# Altium project RPi-rev.1.PrjPcb
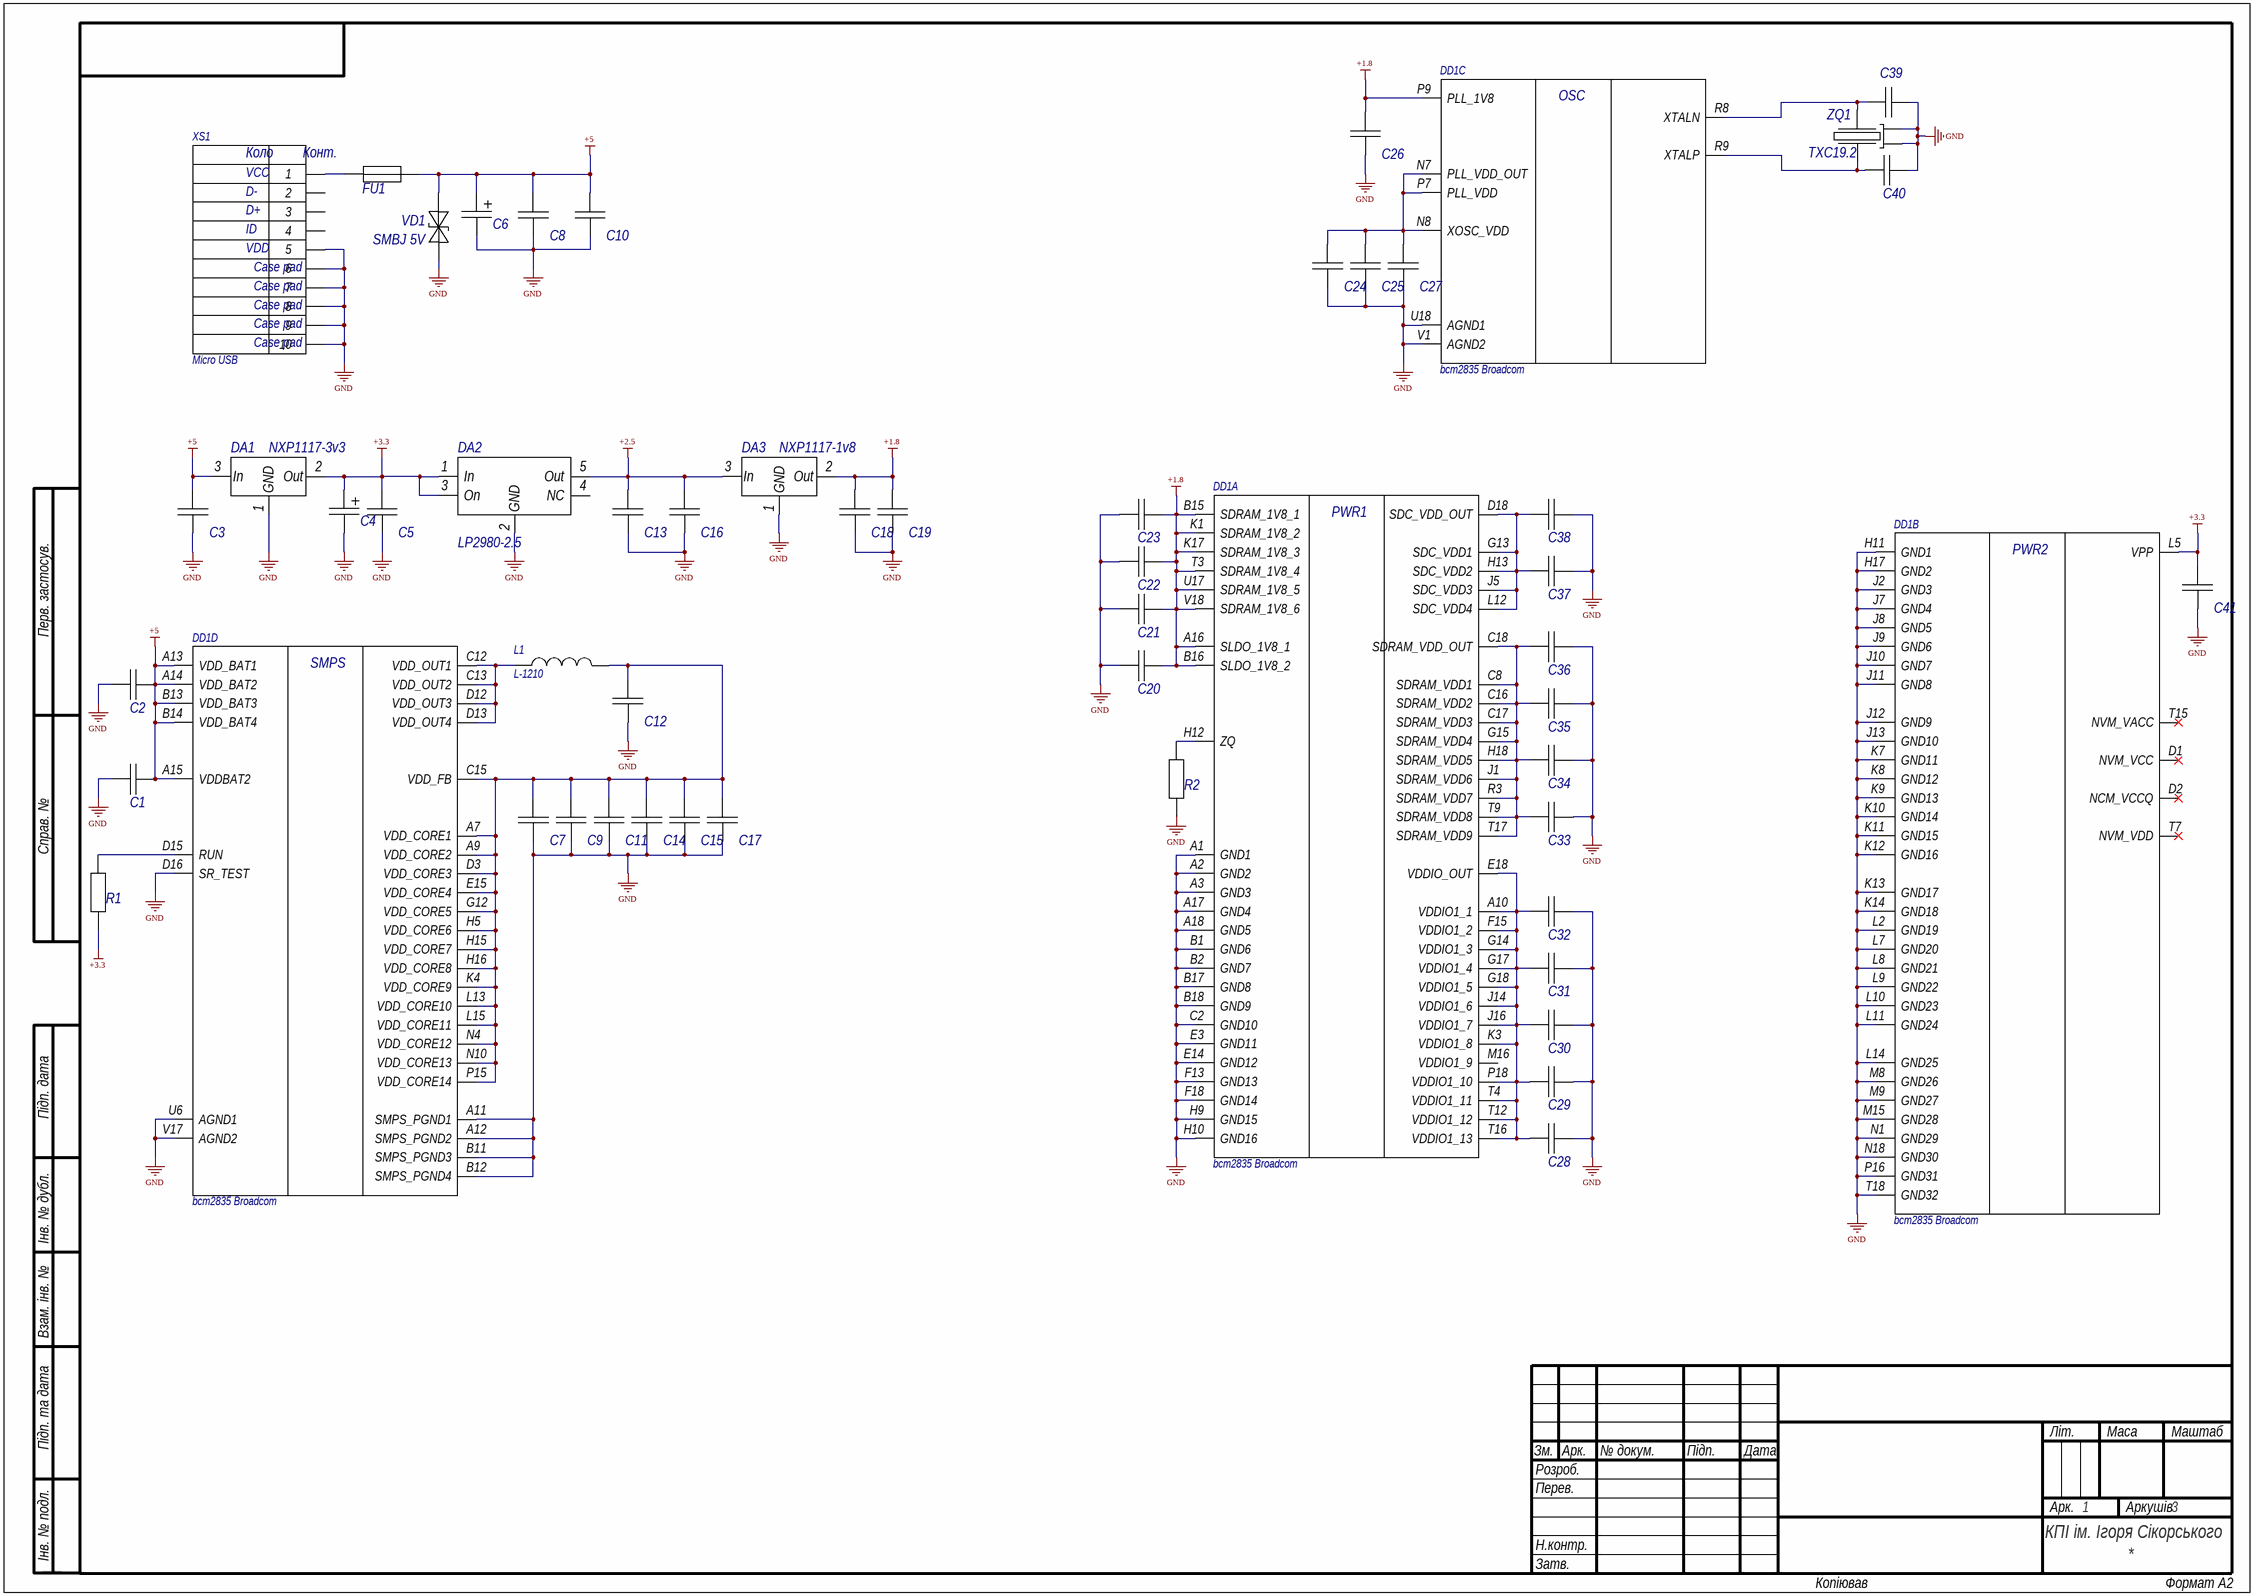
[diagram p0: Power.SchDoc]
3 sheets, 117 parts. Net scope: flat (ports and power ports of the same name join across sheets).
Board file: RPi.PcbDoc
Sheets:
  Power.SchDoc
  HDMI.SchDoc
  LAN.SchDoc

## Sheet Power.SchDoc
size 594 x 420 mm; SheetNumber: 1; SheetTotal: 3

### Parts
C1  C-0603 * * * * *  [С-0603]  (value not drawn)
C2  C-0603 * * * * *  [С-0603]  (value not drawn)
C3  C-0805 * * * * *  [C-0805-KEM]  (value not drawn)
C4  C * * * * *  [PCAP_SVP_C6_PAN]  (value not drawn)
C5  C-0805 * * * * *  [C-0805-KEM]  (value not drawn)
C6  C * * * * *  [PCAP_SVP_C6_PAN]  (value not drawn)
C7  C-0603 * * * * *  [С-0603]  (value not drawn)
C8  C-1206 * * * * *  [C-1206]  (value not drawn)
C9  C-0603 * * * * *  [С-0603]  (value not drawn)
C10  C-0805 * * * * *  [C-0805-KEM]  (value not drawn)
C11  C-0603 * * * * *  [С-0603]  (value not drawn)
C12  C-1206 * * * * *  [C-1206]  (value not drawn)
C13  C-1206 * * * * *  [C-1206]  (value not drawn)
C14  C-0603 * * * * *  [С-0603]  (value not drawn)
C15  C-0603 * * * * *  [С-0603]  (value not drawn)
C16  C-0805 * * * * *  [C-0805-KEM]  (value not drawn)
C17  C-0603 * * * * *  [С-0603]  (value not drawn)
C18  C-0805 * * * * *  [C-0805-KEM]  (value not drawn)
C19  C-0603 * * * * *  [С-0603]  (value not drawn)
C20  C-0603 * * * * *  [С-0603]  (value not drawn)
C21  C-0603 * * * * *  [С-0603]  (value not drawn)
C22  C-0603 * * * * *  [С-0603]  (value not drawn)
C23  C-0603 * * * * *  [С-0603]  (value not drawn)
C24  C-0603 * * * * *  [С-0603]  (value not drawn)
C25  C-0603 * * * * *  [С-0603]  (value not drawn)
C26  C-0603 * * * * *  [С-0603]  (value not drawn)
C27  C-0603 * * * * *  [С-0603]  (value not drawn)
C28  C-0603 * * * * *  [С-0603]  (value not drawn)
C29  C-0603 * * * * *  [С-0603]  (value not drawn)
C30  C-0603 * * * * *  [С-0603]  (value not drawn)
C31  C-0603 * * * * *  [С-0603]  (value not drawn)
C32  C-0603 * * * * *  [С-0603]  (value not drawn)
C33  C-0603 * * * * *  [С-0603]  (value not drawn)
C34  C-0603 * * * * *  [С-0603]  (value not drawn)
C35  C-0603 * * * * *  [С-0603]  (value not drawn)
C36  C-0603 * * * * *  [С-0603]  (value not drawn)
C37  C-0603 * * * * *  [С-0603]  (value not drawn)
C38  C-0603 * * * * *  [С-0603]  (value not drawn)
C39  C-0402 * * * * *  [C-0402]  (value not drawn)
C40  C-0402 * * * * *  [C-0402]  (value not drawn)
C41  C-0603 * * * * *  [С-0603]  (value not drawn)
DA1  NXP1117-3v3  [D2PAK3_ONS]
DA2  LP2980-2.5  [MF05A_TEX-L]
DA3  NXP1117-1v8  [D2PAK3_ONS]
DD1  bcm2835 Broadcom  [BGA81C65P18X18_1200X1200]  (parts A,B,C,D of 16)
FU1  F-1206 * * * *  [FUSE_1206]  (value not drawn)
L1  L-1210  [IND_NC_SUM]
R1  R-0603 * * * *  [R-0603]  (value not drawn)
R2  R-0603 * * * *  [R-0603]  (value not drawn)
VD1  SMBJ 5V *  [SMB_STM]  (value not drawn)
XS1  Micro USB  [micro-usb]
ZQ1  TXC19.2 *  [CRYSTAL_TXC_7B]  (value not drawn)

### Nets
+1.8: C18.2 C19.2 C20.2 C21.2 C22.2 C23.2 C26.2 DA3.2(Out) DD1.A16(SLDO_1V8_1) DD1.B15(SDRAM_1V8_1) DD1.B16(SLDO_1V8_2) DD1.K1(SDRAM_1V8_2) DD1.K17(SDRAM_1V8_3) DD1.P9(PLL_1V8) DD1.T3(SDRAM_1V8_4) DD1.U17(SDRAM_1V8_5) DD1.V18(SDRAM_1V8_6)
+2.5: C13.2 C16.2 DA2.5(Out) DA3.3(In)
+3.3: C4.1 C5.2 C41.2 DA1.2(Out) DA2.1(In) DA2.3(On) DD1.L5(VPP) R1.2
+5: C1.1 C2.1 C3.2 C6.1 C8.2 C10.2 DA1.3(In) DD1.A13(VDD_BAT1) DD1.A14(VDD_BAT2) DD1.A15(VDDBAT2) DD1.B13(VDD_BAT3) DD1.B14(VDD_BAT4) FU1.2 VD1.2
GND: C1.2 C2.2 C3.1 C4.2 C5.1 C6.2 C7.1 C8.1 C9.1 C10.1 C11.1 C12.1 C13.1 C14.1 C15.1 C16.1 C17.1 C18.1 C19.1 C20.1 C21.1 C22.1 C23.1 C24.1 C25.1 C26.1 C27.1 C28.1 C29.1 C30.1 C31.1 C32.1 C33.1 C34.1 C35.1 C36.1 C37.1 C38.1 C39.2 C40.2 C41.1 DA1.1(GND) DA2.2(GND) DA3.1(GND) DD1.A1(GND1) DD1.A2(GND2) DD1.A3(GND3) DD1.A11(SMPS_PGND1) DD1.A12(SMPS_PGND2) DD1.A17(GND4) DD1.A18(GND5) DD1.B1(GND6) DD1.B2(GND7) DD1.B11(SMPS_PGND3) DD1.B12(SMPS_PGND4) DD1.B17(GND8) DD1.B18(GND9) DD1.C2(GND10) DD1.D16(SR_TEST) DD1.E3(GND11) DD1.E14(GND12) DD1.F13(GND13) DD1.F18(GND14) DD1.H9(GND15) DD1.H10(GND16) DD1.H11(GND1) DD1.H17(GND2) DD1.J2(GND3) DD1.J7(GND4) DD1.J8(GND5) DD1.J9(GND6) DD1.J10(GND7) DD1.J11(GND8) DD1.J12(GND9) DD1.J13(GND10) DD1.K7(GND11) DD1.K8(GND12) DD1.K9(GND13) DD1.K10(GND14) DD1.K11(GND15) DD1.K12(GND16) DD1.K13(GND17) DD1.K14(GND18) DD1.L2(GND19) DD1.L7(GND20) DD1.L8(GND21) DD1.L9(GND22) DD1.L10(GND23) DD1.L11(GND24) DD1.L14(GND25) DD1.M8(GND26) DD1.M9(GND27) DD1.M15(GND28) DD1.N1(GND29) DD1.N18(GND30) DD1.P16(GND31) DD1.T18(GND32) DD1.U6(AGND1) DD1.U18(AGND1) DD1.V1(AGND2) DD1.V17(AGND2) R2.1 VD1.1 XS1.5 XS1.6 XS1.7 XS1.8 XS1.9 XS1.10 ZQ1.2 ZQ1.4
NetC7_2: C7.2 C9.2 C11.2 C12.2 C14.2 C15.2 C17.2 DD1.A7(VDD_CORE1) DD1.A9(VDD_CORE2) DD1.C15(VDD_FB) DD1.D3(VDD_CORE3) DD1.E15(VDD_CORE4) DD1.G12(VDD_CORE5) DD1.H5(VDD_CORE6) DD1.H15(VDD_CORE7) DD1.H16(VDD_CORE8) DD1.K4(VDD_CORE9) DD1.L13(VDD_CORE10) DD1.L15(VDD_CORE11) DD1.N4(VDD_CORE12) DD1.N10(VDD_CORE13) DD1.P15(VDD_CORE14) L1.2
NetC24_2: C24.2 C25.2 C27.2 DD1.N7(PLL_VDD_OUT) DD1.N8(XOSC_VDD) DD1.P7(PLL_VDD)
NetC28_2: C28.2 C29.2 C30.2 C31.2 C32.2 DD1.A10(VDDIO1_1) DD1.E18(VDDIO_OUT) DD1.F15(VDDIO1_2) DD1.G14(VDDIO1_3) DD1.G17(VDDIO1_4) DD1.G18(VDDIO1_5) DD1.J14(VDDIO1_6) DD1.J16(VDDIO1_7) DD1.K3(VDDIO1_8) DD1.P18(VDDIO1_10) DD1.T4(VDDIO1_11) DD1.T12(VDDIO1_12) DD1.T16(VDDIO1_13)
NetC33_2: C33.2 C34.2 C35.2 C36.2 DD1.G15(SDRAM_VDD4) DD1.H18(SDRAM_VDD5) DD1.J1(SDRAM_VDD6) DD1.R3(SDRAM_VDD7) DD1.T9(SDRAM_VDD8) DD1.T17(SDRAM_VDD9) DD1.С8(SDRAM_VDD1) DD1.С16(SDRAM_VDD2) DD1.С17(SDRAM_VDD3) DD1.С18(SDRAM_VDD_OUT)
NetC37_2: C37.2 C38.2 DD1.D18(SDC_VDD_OUT) DD1.G13(SDC_VDD1) DD1.H13(SDC_VDD2) DD1.J5(SDC_VDD3) DD1.L12(SDC_VDD4)
NetC39_1: C39.1 DD1.R8(XTALN) ZQ1.3
NetC40_1: C40.1 DD1.R9(XTALP) ZQ1.1
NetDD1_C12: DD1.C12(VDD_OUT1) DD1.C13(VDD_OUT2) DD1.D12(VDD_OUT3) DD1.D13(VDD_OUT4) L1.1
NetDD1_D15: DD1.D15(RUN) R1.1
NetDD1_H12: DD1.H12(ZQ) R2.2
NetFU1_1: FU1.1 XS1.1

Not connected (* = marked no-connect by the designer): DA2 4(NC); DD1 D1(NVM_VCC)* D2(NCM_VCCQ)* M16(VDDIO1_9) T7(NVM_VDD)* T15(NVM_VACC)*; XS1 2 3 4

### Notes on the sheet
- Перв. застосув.
- Справ. №
- Підп. дата
- Інв. № дубл.
- Взам. інв. №
- Підп. та дата
- Зм.
- Розроб.
- Арк.
- № докум.
- Підп.
- Дата
- Літ.
- Маса
- Маштаб
- Перев.
- Аркушів
- Інв. № подл.
- Н.контр.
- Затв.
- КПІ ім. Ігоря Сікорського
- ALTIUM GOSTBOM2.0 KEV
- Копіював
- Формат А2
- (in symbol bcm2835, part A) PWR1
- (in symbol bcm2835, part B) PWR2
- (in symbol bcm2835, part C) OSC
- (in symbol bcm2835, part D) SMPS
- (in symbol Micro-USB) Коло; Конт.; VCC; D-; D+; ID; VDD; Case pad

### Library data of the parts
C1 C2 C7 C9 C11 C14 C15 C17 C19-C38 C41 = С-0603: Generic; Manufacturer: *; Tolerance: *; Package: C-0603; Temp_Coef: *; Voltage: *; Value: *
C3 C5 C10 C16 C18 = С-0805: Generic; Manufacturer: *; Tolerance: *; Package: C-0805; Temp_Coef: *; Voltage: *; Value: *
C4 C6 = С: Generic electrolite SMT capacitor; Manufacturer: *; Tolerance: *; Package: C; Temp_Coef: *; Voltage: *; Value: *
C8 C12 C13 = С-1206: Generic; Manufacturer: *; Tolerance: *; Package: C-1206; Temp_Coef: *; Voltage: *; Value: *
C39 C40 = С-0402: Generic; Manufacturer: *; Tolerance: *; Package: C-0402; Temp_Coef: *; Voltage: *; Value: *
DA1 = NXP1117-3v3: LDO aat output 3.3V
DA2 = LP2980-2.5: LDO at output 2.5V
DA3 = NXP1117-1v8: LDO aat output 1.8V
DD1 = bcm2835: BCM2835 ARM-based processor; Manufacturer: Broadcom; Name: bcm2835
FU1 = F-1206: Generic Fuse 1206; Manufacturer: *; Tolerance: *; Package: F-1206; Power: *; Value: *
L1 = L-1210: Inductor; Name: L-1210
R1 R2 = R-0603: Generic; Manufacturer: *; Tolerance: *; Package: R-0603; Power: *; Value: *
VD1 = SMBJ 5V: TVS 5V Diode; Manufacturer: *; Name: SMBJ 5V
XS1 = Micro-USB: Micro-USB connector for SMT mounting; Name: kls1-tf
ZQ1 = TXC19.2: TXC19.2 crystal 19.2 MHz; Manufacturer: *; Value: *; Name: TXC19.2

## Sheet HDMI.SchDoc
size 593 x 419 mm; SheetNumber: 2; SheetTotal: 3
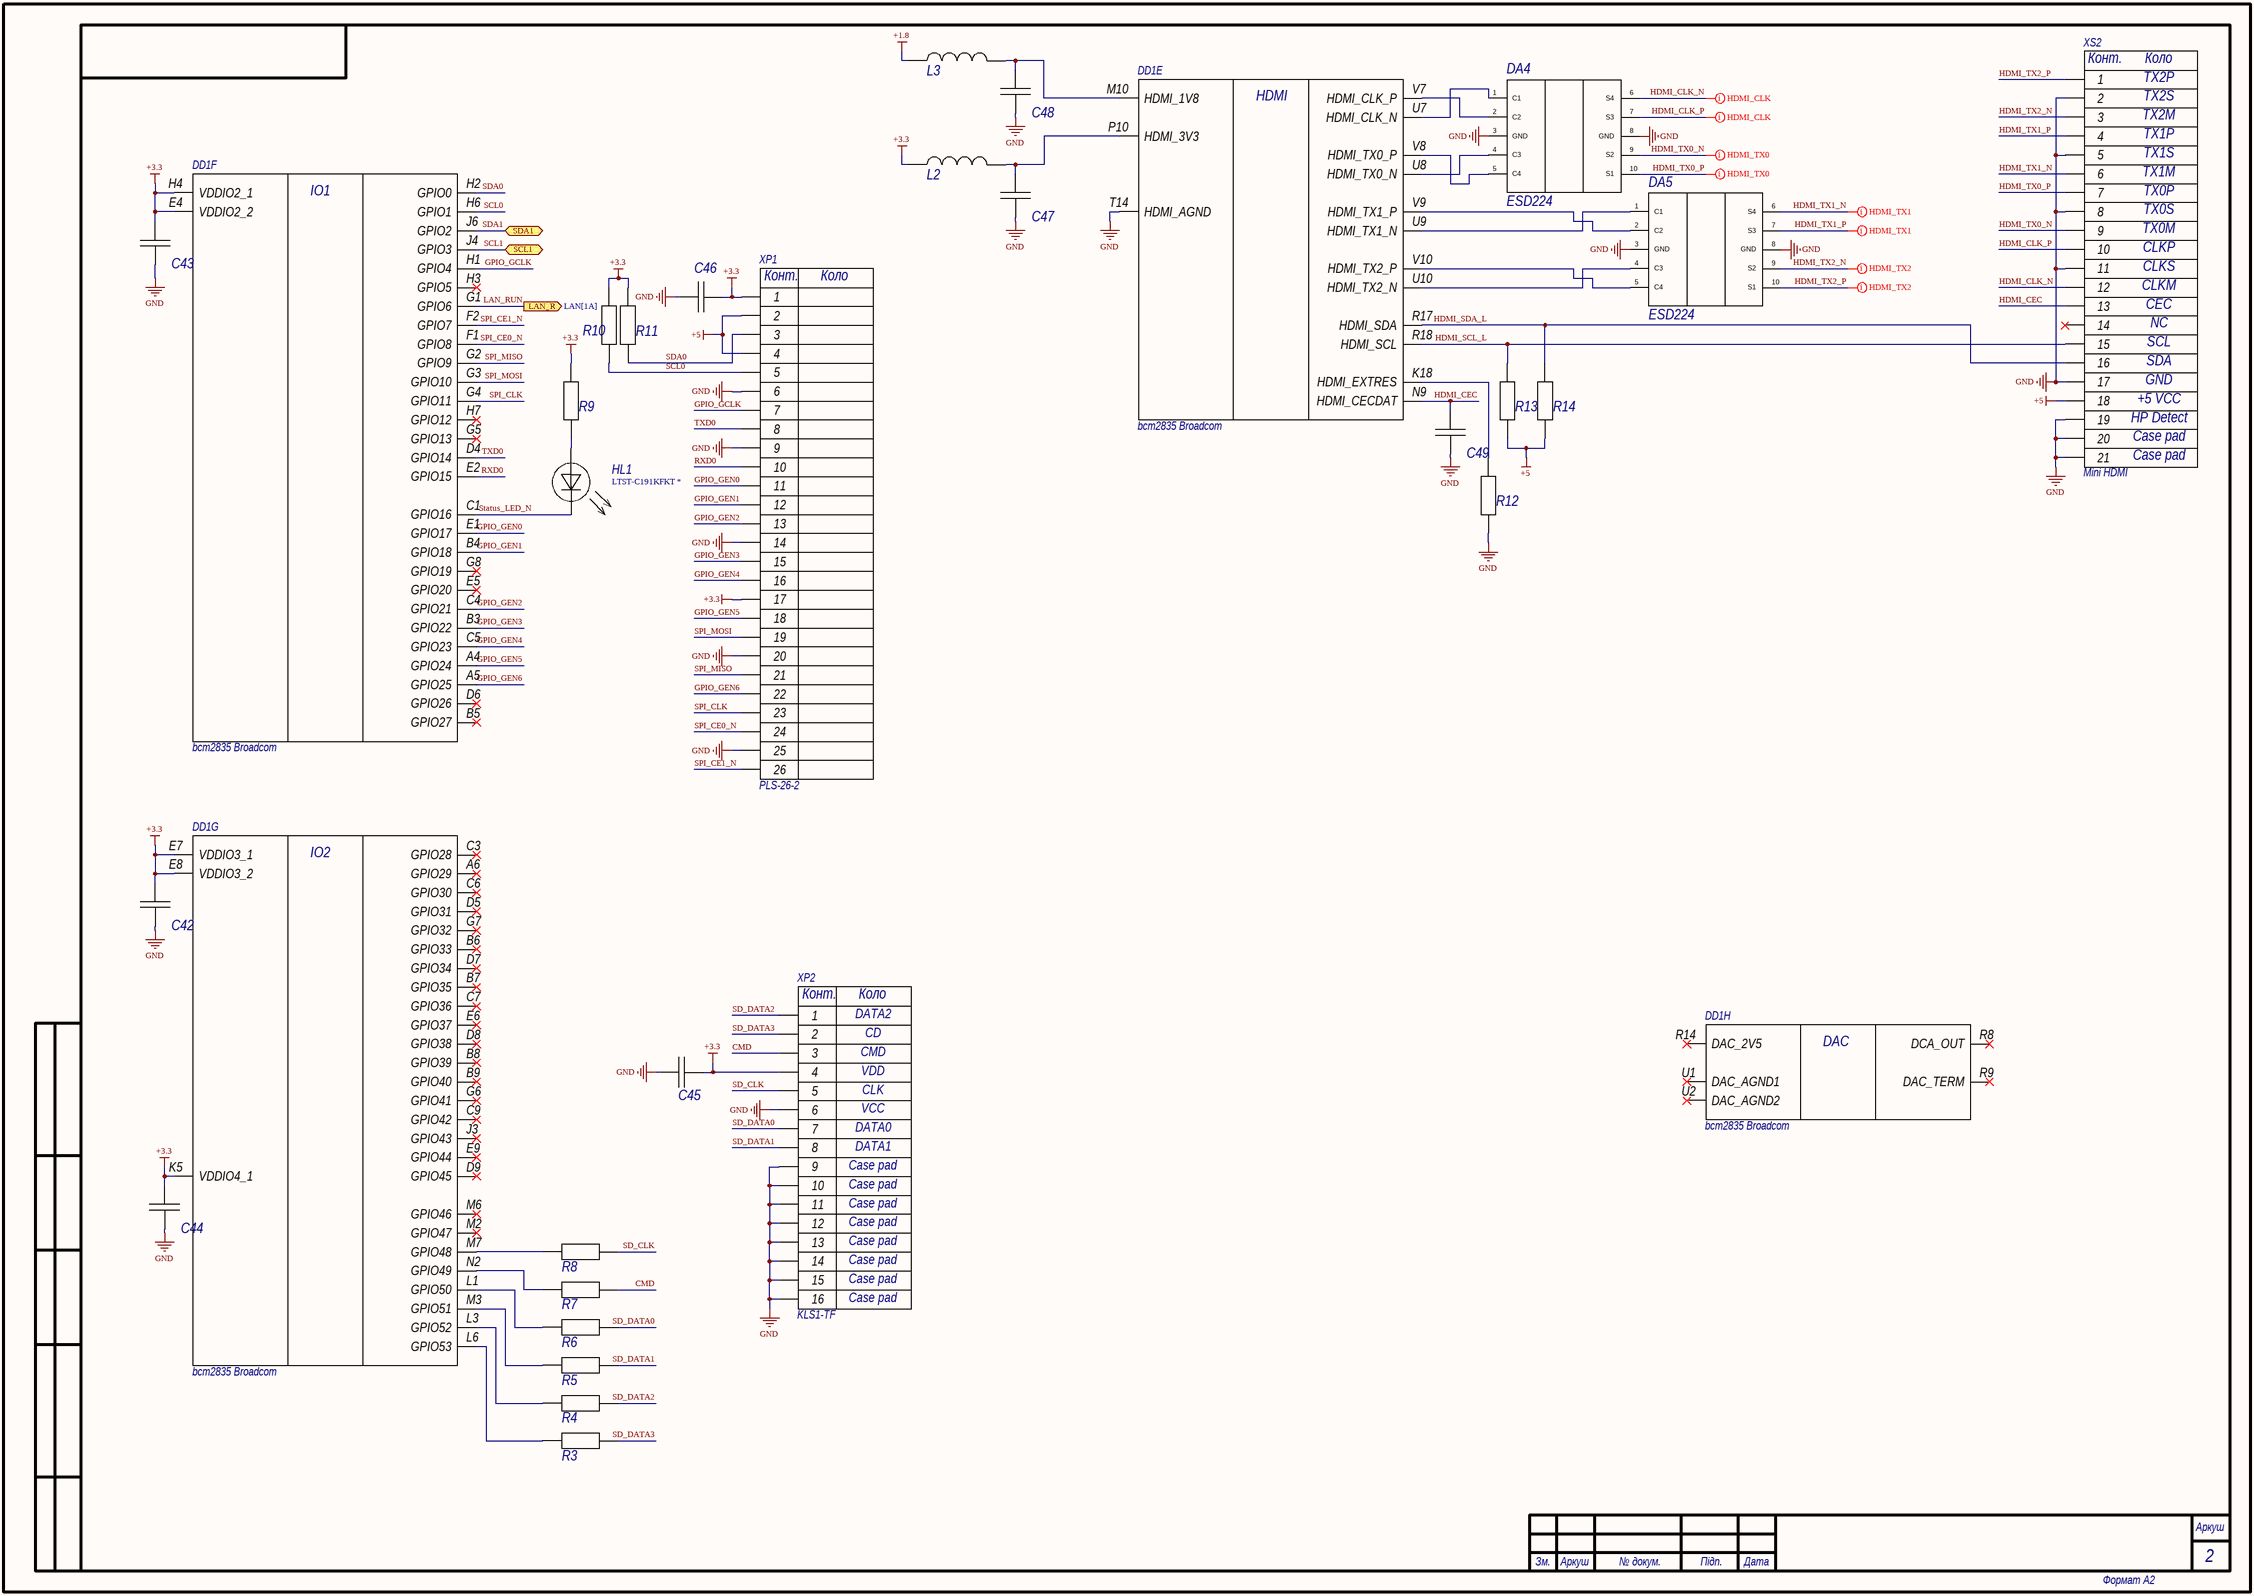
[diagram p1: HDMI.SchDoc]

### Parts
C42  C-0603 * * * * *  [С-0603]  (value not drawn)
C43  C-0603 * * * * *  [С-0603]  (value not drawn)
C44  C-0603 * * * * *  [С-0603]  (value not drawn)
C45  C-0603 * * * * *  [С-0603]  (value not drawn)
C46  C-0603 * * * * *  [С-0603]  (value not drawn)
C47  C-0805 * * * * *  [C-0805-KEM]  (value not drawn)
C48  C-0805 * * * * *  [C-0805-KEM]  (value not drawn)
C49  C-0402 * * * * *  [C-0402]  (value not drawn)
DA4  ESD224 *  [DQA0010A]  (value not drawn)
DA5  ESD224 *  [DQA0010A]  (value not drawn)
DD1  bcm2835 Broadcom  [BGA81C65P18X18_1200X1200]  (parts E,F,G,H of 16)
HL1  LTST-C191KFKT *  [LED_DIALIGHT_598_DIA]
L2  R-0402 * * * *  [FB-0805]  (value not drawn)
L3  R-0402 * * * *  [FB-0805]  (value not drawn)
R3  R-0603 * * * *  [R-0603]  (value not drawn)
R4  R-0603 * * * *  [R-0603]  (value not drawn)
R5  R-0603 * * * *  [R-0603]  (value not drawn)
R6  R-0603 * * * *  [R-0603]  (value not drawn)
R7  R-0603 * * * *  [R-0603]  (value not drawn)
R8  R-0603 * * * *  [R-0603]  (value not drawn)
R9  R-0603 * * * *  [R-0603]  (value not drawn)
R10  R-0402 * * * *  [R-0402]  (value not drawn)
R11  R-0402 * * * *  [R-0402]  (value not drawn)
R12  R-0402 * * * *  [R-0402]  (value not drawn)
R13  R-0402 * * * *  [R-0402]  (value not drawn)
R14  R-0402 * * * *  [R-0402]  (value not drawn)
XP1  PLS-26-2  [26 pin 2.54mm pitch 2 row]
XP2  KLS1-TF  [504077-1891_MOL]
XS2  Mini HDMI  [mini HDMI]

### Ports
LAN_R (out, see LAN[1A]), SCL1 (bidir), SDA1 (bidir)

### Nets
+1.8: L3.1
+3.3: C42.1 C43.2 C44.1 C45.1 C46.2 DD1.E4(VDDIO2_2) DD1.E7(VDDIO3_1) DD1.E8(VDDIO3_2) DD1.H4(VDDIO2_1) DD1.K5(VDDIO4_1) L2.1 R9.2 R10.2 R11.2 XP1.1 XP1.17 XP2.4
+5: R13.2 R14.2 XP1.2 XP1.4 XS2.18
GND: C42.2 C43.1 C44.2 C45.2 C46.1 C47.2 C48.2 C49.1 DA4.3(GND) DA4.8(GND) DA5.3(GND) DA5.8(GND) DD1.T14(HDMI_AGND) R12.1 XP1.6 XP1.9 XP1.14 XP1.20 XP1.25 XP2.6 XP2.9 XP2.10 XP2.11 XP2.12 XP2.13 XP2.14 XP2.15 XP2.16 XS2.2 XS2.5 XS2.8 XS2.11 XS2.17 XS2.19 XS2.20 XS2.21
CMD: R7.2 XP2.3
GPIO_GCLK: DD1.H1(GPIO4) XP1.7
GPIO_GEN0: DD1.E1(GPIO17) XP1.11
GPIO_GEN1: DD1.B4(GPIO18) XP1.12
GPIO_GEN2: DD1.C4(GPIO21) XP1.13
GPIO_GEN3: DD1.B3(GPIO22) XP1.15
GPIO_GEN4: DD1.C5(GPIO23) XP1.16
GPIO_GEN5: DD1.A4(GPIO24) XP1.18
GPIO_GEN6: DD1.A5(GPIO25) XP1.22
HDMI_CEC: C49.2 DD1.N9(HDMI_CECDAT) XS2.13
HDMI_CLK_N: DA4.6(S4) XS2.12
HDMI_CLK_P: DA4.7(S3) XS2.10
HDMI_SCL_L: DD1.R18(HDMI_SCL) R13.1 XS2.15
HDMI_SDA_L: DD1.R17(HDMI_SDA) R14.1 XS2.16
HDMI_TX0_N: DA4.9(S2) XS2.9
HDMI_TX0_P: DA4.10(S1) XS2.7
HDMI_TX1_N: DA5.6(S4) XS2.6
HDMI_TX1_P: DA5.7(S3) XS2.4
HDMI_TX2_N: DA5.9(S2) XS2.3
HDMI_TX2_P: DA5.10(S1) XS2.1
LAN_RUN: DD1.G1(GPIO6) ; port LAN_R
RXD0: DD1.E2(GPIO15) XP1.10
SCL0: DD1.H6(GPIO1) R10.1 XP1.5
SCL1: DD1.J4(GPIO3) ; port SCL1
SD_CLK: R8.2 XP2.5
SD_DATA0: R6.2 XP2.7
SD_DATA1: R5.2 XP2.8
SD_DATA2: R4.2 XP2.1
SD_DATA3: R3.2 XP2.2
SDA0: DD1.H2(GPIO0) R11.1 XP1.3
SDA1: DD1.J6(GPIO2) ; port SDA1
SPI_CE0_N: DD1.F1(GPIO8) XP1.24
SPI_CE1_N: DD1.F2(GPIO7) XP1.26
SPI_CLK: DD1.G4(GPIO11) XP1.23
SPI_MISO: DD1.G2(GPIO9) XP1.21
SPI_MOSI: DD1.G3(GPIO10) XP1.19
Status_LED_N: DD1.C1(GPIO16) HL1.2
TXD0: DD1.D4(GPIO14) XP1.8
NetC39_1: DD1.R8(DCA_OUT)
NetC40_1: DD1.R9(DAC_TERM)
NetC47_1: C47.1 DD1.P10(HDMI_3V3) L2.2
NetC48_1: C48.1 DD1.M10(HDMI_1V8) L3.2
NetDA4_1: DA4.1(C1) DD1.U7(HDMI_CLK_N)
NetDA4_2: DA4.2(C2) DD1.V7(HDMI_CLK_P)
NetDA4_4: DA4.4(C3) DD1.U8(HDMI_TX0_N)
NetDA4_5: DA4.5(C4) DD1.V8(HDMI_TX0_P)
NetDA5_1: DA5.1(C1) DD1.U9(HDMI_TX1_N)
NetDA5_2: DA5.2(C2) DD1.V9(HDMI_TX1_P)
NetDA5_4: DA5.4(C3) DD1.U10(HDMI_TX2_N)
NetDA5_5: DA5.5(C4) DD1.V10(HDMI_TX2_P)
NetDD1_K18: DD1.K18(HDMI_EXTRES) R12.2
NetDD1_L1: DD1.L1(GPIO50) R6.1
NetDD1_L3: DD1.L3(GPIO52) R4.1
NetDD1_L6: DD1.L6(GPIO53) R3.1
NetDD1_M3: DD1.M3(GPIO51) R5.1
NetDD1_M7: DD1.M7(GPIO48) R8.1
NetDD1_N2: DD1.N2(GPIO49) R7.1
NetHL1_1: HL1.1 R9.1

Not connected (* = marked no-connect by the designer): DD1 A6(GPIO29)* B5(GPIO27)* B6(GPIO33)* B7(GPIO35)* B8(GPIO39)* B9(GPIO40)* C3(GPIO28)* C6(GPIO30)* C7(GPIO36)* C9(GPIO42)* D5(GPIO31)* D6(GPIO26)* D7(GPIO34)* D8(GPIO38)* D9(GPIO45)* E5(GPIO20)* E6(GPIO37)* E9(GPIO44)* G5(GPIO13)* G6(GPIO41)* G7(GPIO32)* G8(GPIO19)* H3(GPIO5)* H7(GPIO12)* J3(GPIO43)* M2(GPIO47)* M6(GPIO46)* R14(DAC_2V5)* U1(DAC_AGND1)* U2(DAC_AGND2)*; XS2 14*

### Layout directives
differential pair: HDMI_CLK_N, HDMI_CLK_P, HDMI_TX0_N, HDMI_TX0_P, HDMI_TX1_N, HDMI_TX1_P, HDMI_TX2_N, HDMI_TX2_P

### Notes on the sheet
- Аркуш
- Зм.
- № докум.
- Підп.
- Дата
- Формат А2
- (in symbol bcm2835, part E) HDMI
- (in symbol bcm2835, part F) IO1
- (in symbol bcm2835, part G) IO2
- (in symbol bcm2835, part H) DAC
- (in symbol kls1-tf) Конт.; Коло; DATA2; CD; CMD; VDD; CLK; VCC; DATA0; DATA1; Case pad
- (in symbol Mini HDMI) Конт.; Коло; TX2P; TX2S; TX2M; TX1P; TX1S; TX1M; TX0P; TX0S; TX0M; CLKP; CLKS; CLKM; CEC; NC; SCL; SDA; GND; +5 VCC; HP Detect; Case pad
- (in symbol PLS-26-2) Конт.; Коло

### Library data of the parts
C42-C46 = С-0603: Generic; Manufacturer: *; Tolerance: *; Package: C-0603; Temp_Coef: *; Voltage: *; Value: *
C47 C48 = С-0805: Generic; Manufacturer: *; Tolerance: *; Package: C-0805; Temp_Coef: *; Voltage: *; Value: *
C49 = С-0402: Generic; Manufacturer: *; Tolerance: *; Package: C-0402; Temp_Coef: *; Voltage: *; Value: *
DA4 DA5 = ESD224: bav99 double diode; Manufacturer: *; Name: ESD224
DD1 = bcm2835: BCM2835 ARM-based processor; Manufacturer: Broadcom; Name: bcm2835
HL1 = LED 0603: Generic LED 0603; Manufacturer: *; Name: LTST-C191KFKT
L2 L3 = Ferrite Bead 0805: Generic; Manufacturer: *; Tolerance: *; Package: R-0402; Power: *; Value: *
R3-R9 = R-0603: Generic; Manufacturer: *; Tolerance: *; Package: R-0603; Power: *; Value: *
R10-R14 = R-0402: Generic; Manufacturer: *; Tolerance: *; Package: R-0402; Power: *; Value: *
XP1 = PLS-26-2: PLS connector 26 pin 2.54mm pitch 2 rows; Name: PLS-26-2
XP2 = kls1-tf: Micro-SD card connector SMT mounting; Name: kls1-tf
XS2 = Mini HDMI: Name: Mini HDMI

## Sheet LAN.SchDoc
size 593 x 419 mm; SheetNumber: 3; SheetTotal: 3
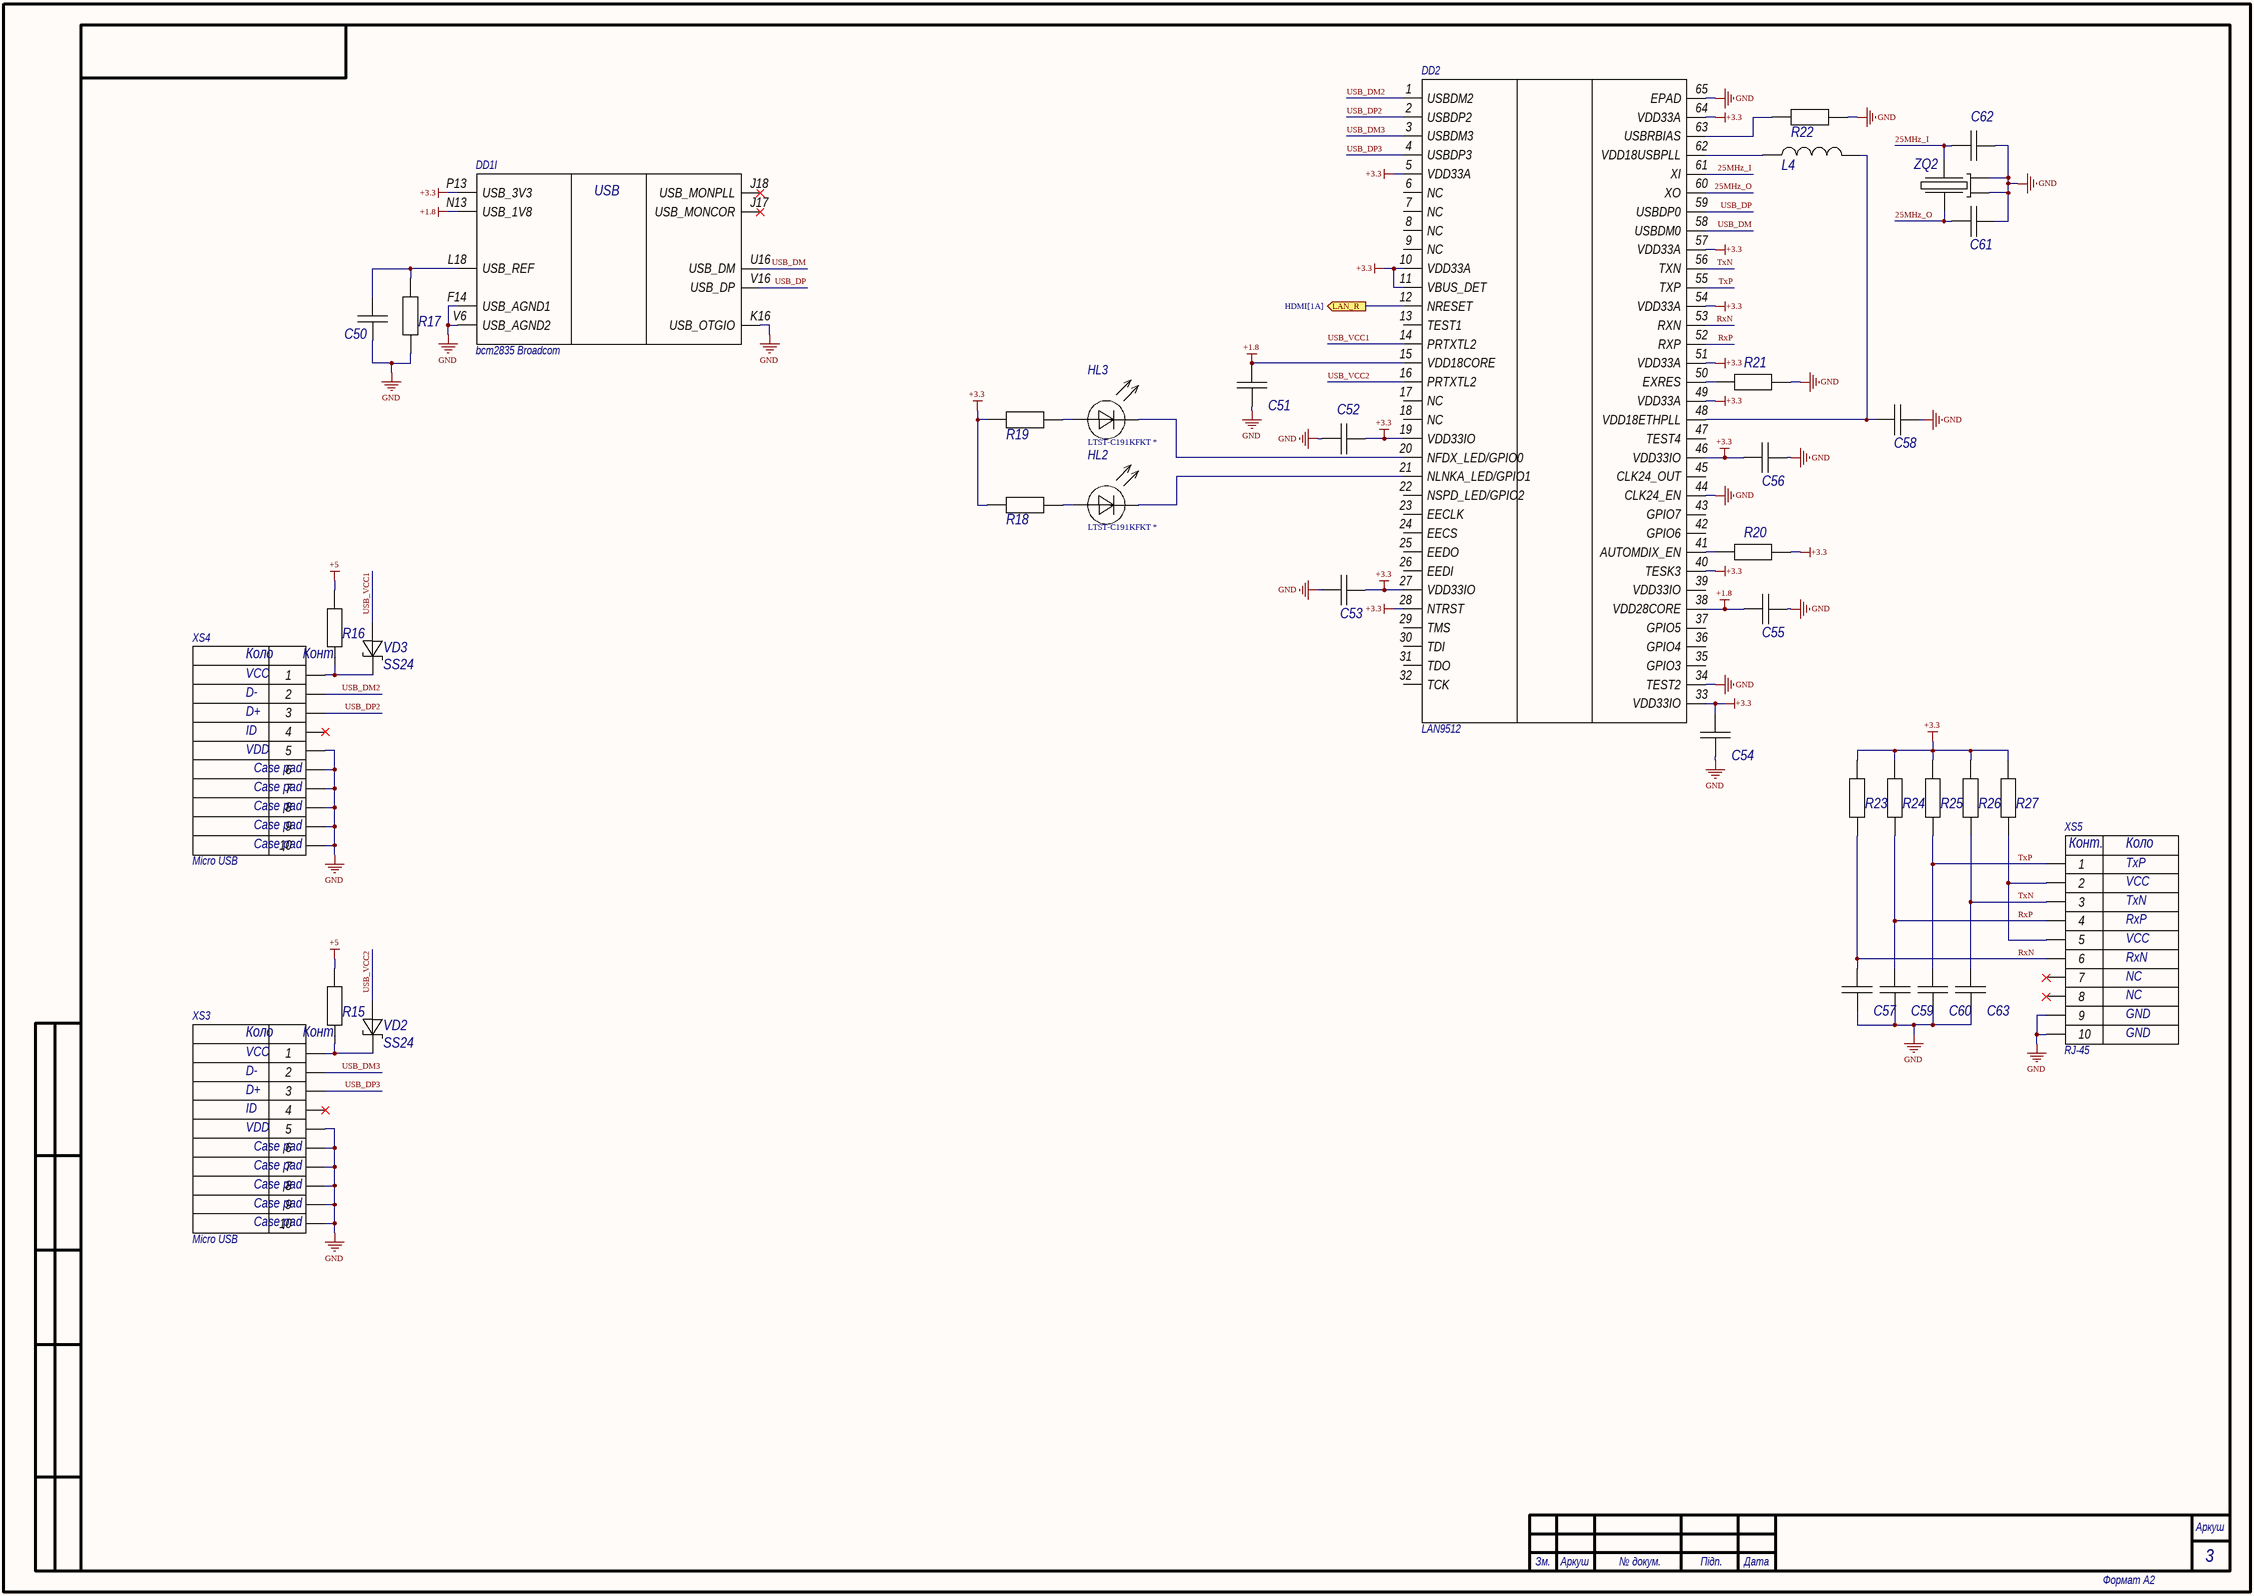
[diagram p2: LAN.SchDoc]

### Parts
C50  C-0603 * * * * *  [С-0603]  (value not drawn)
C51  C-0402 * * * * *  [C-0402]  (value not drawn)
C52  C-0402 * * * * *  [C-0402]  (value not drawn)
C53  C-0402 * * * * *  [C-0402]  (value not drawn)
C54  C-0402 * * * * *  [C-0402]  (value not drawn)
C55  C-0402 * * * * *  [C-0402]  (value not drawn)
C56  C-0402 * * * * *  [C-0402]  (value not drawn)
C57  C-0603 * * * * *  [С-0603]  (value not drawn)
C58  C-0402 * * * * *  [C-0402]  (value not drawn)
C59  C-0603 * * * * *  [С-0603]  (value not drawn)
C60  C-0603 * * * * *  [С-0603]  (value not drawn)
C61  C-0402 * * * * *  [C-0402]  (value not drawn)
C62  C-0402 * * * * *  [C-0402]  (value not drawn)
C63  C-0603 * * * * *  [С-0603]  (value not drawn)
DD1  bcm2835 Broadcom  [BGA81C65P18X18_1200X1200]  (part I of 16)
DD2  LAN9512  [QFN64_9x9MC_MCH]
HL2  LTST-C191KFKT *  [LED_DIALIGHT_598_DIA]
HL3  LTST-C191KFKT *  [LED_DIALIGHT_598_DIA]
L4  R-0402 * * * *  [FB-0805]  (value not drawn)
R15  R-0603 * * * *  [R-0603]  (value not drawn)
R16  R-0603 * * * *  [R-0603]  (value not drawn)
R17  R-0603 * * * *  [R-0603]  (value not drawn)
R18  R-0603 * * * *  [R-0603]  (value not drawn)
R19  R-0603 * * * *  [R-0603]  (value not drawn)
R20  R-0402 * * * *  [R-0402]  (value not drawn)
R21  R-0402 * * * *  [R-0402]  (value not drawn)
R22  R-0402 * * * *  [R-0402]  (value not drawn)
R23  R-0603 * * * *  [R-0603]  (value not drawn)
R24  R-0603 * * * *  [R-0603]  (value not drawn)
R25  R-0603 * * * *  [R-0603]  (value not drawn)
R26  R-0603 * * * *  [R-0603]  (value not drawn)
R27  R-0603 * * * *  [R-0603]  (value not drawn)
VD2  SS24 *  [SS14]  (value not drawn)
VD3  SS24 *  [SS14]  (value not drawn)
XS3  Micro USB  [micro-usb]
XS4  Micro USB  [micro-usb]
XS5  RJ-45  [CONN8_2041126-1_TEC]
ZQ2  TXC19.2 *  [CRYSTAL_TXC_7B]  (value not drawn)

### Ports
LAN_R (out, see HDMI[1A])

### Nets
+1.8: C51.2 C55.2 DD1.N13(USB_1V8) DD2.15(VDD18CORE) DD2.38(VDD28CORE)
+3.3: C52.2 C53.2 C54.2 C56.2 DD1.P13(USB_3V3) DD2.5(VDD33A) DD2.10(VDD33A) DD2.11(VBUS_DET) DD2.19(VDD33IO) DD2.27(VDD33IO) DD2.28(NTRST) DD2.33(VDD33IO) DD2.40(TESK3) DD2.46(VDD33IO) DD2.49(VDD33A) DD2.51(VDD33A) DD2.54(VDD33A) DD2.57(VDD33A) DD2.64(VDD33A) R18.1 R19.1 R20.2 R23.1 R24.1 R25.1 R26.1 R27.1
+5: R15.2 R16.2
GND: C50.1 C51.1 C52.1 C53.1 C54.1 C55.1 C56.1 C57.2 C58.1 C59.2 C60.2 C61.2 C62.2 C63.2 DD1.F14(USB_AGND1) DD1.K16(USB_OTGIO) DD1.V6(USB_AGND2) DD2.34(TEST2) DD2.44(CLK24_EN) DD2.65(EPAD) R17.1 R21.2 R22.2 XS3.5 XS3.6 XS3.7 XS3.8 XS3.9 XS3.10 XS4.5 XS4.6 XS4.7 XS4.8 XS4.9 XS4.10 XS5.9 XS5.10 ZQ2.2 ZQ2.4
25MHz_I: C62.1 DD2.61(XI) ZQ2.3
25MHz_O: C61.1 DD2.60(XO) ZQ2.1
LAN_RUN: DD2.12(NRESET) ; port LAN_R
RxN: C57.1 DD2.53(RXN) R23.2 XS5.6
RxP: C59.1 DD2.52(RXP) R24.2 XS5.4
TxN: C63.1 DD2.56(TXN) R26.2 XS5.3
TxP: C60.1 DD2.55(TXP) R25.2 XS5.1
USB_DM: DD1.U16(USB_DM) DD2.58(USBDM0)
USB_DM2: DD2.1(USBDM2) XS4.2
USB_DM3: DD2.3(USBDM3) XS3.2
USB_DP: DD1.V16(USB_DP) DD2.59(USBDP0)
USB_DP2: DD2.2(USBDP2) XS4.3
USB_DP3: DD2.4(USBDP3) XS3.3
USB_VCC1: DD2.14(PRTXTL2) VD3.1
USB_VCC2: DD2.16(PRTXTL2) VD2.1
NetC50_2: C50.2 DD1.L18(USB_REF) R17.2
NetC58_2: C58.2 DD2.48(VDD18ETHPLL) L4.2
NetDD2_20: DD2.20(NFDX_LED/GPIO0) HL3.2
NetDD2_21: DD2.21(NLNKA_LED/GPIO1) HL2.2
NetDD2_41: DD2.41(AUTOMDIX_EN) R20.1
NetDD2_50: DD2.50(EXRES) R21.1
NetDD2_62: DD2.62(VDD18USBPLL) L4.1
NetDD2_63: DD2.63(USBRBIAS) R22.1
NetHL2_1: HL2.1 R18.2
NetHL3_1: HL3.1 R19.2
NetR15_1: R15.1 VD2.2 XS3.1
NetR16_1: R16.1 VD3.2 XS4.1
NetR27_2: R27.2 XS5.2 XS5.5

Not connected (* = marked no-connect by the designer): DD1 J17(USB_MONCOR)* J18(USB_MONPLL)*; DD2 6(NC) 7(NC) 8(NC) 9(NC) 13(TEST1) 17(NC) 18(NC) 22(NSPD_LED/GPIO2) 23(EECLK) 24(EECS) 25(EEDO) 26(EEDI) 29(TMS) 30(TDI) 31(TDO) 32(TCK) 35(GPIO3) 36(GPIO4) 37(GPIO5) 39(VDD33IO) 42(GPIO6) 43(GPIO7) 45(CLK24_OUT) 47(TEST4); XS3 4*; XS4 4*; XS5 7* 8*

### Notes on the sheet
- Аркуш
- Зм.
- № докум.
- Підп.
- Дата
- Формат А2
- (in symbol bcm2835, part I) USB
- (in symbol Micro-USB) Коло; Конт.; VCC; D-; D+; ID; VDD; Case pad
- (in symbol RJ-45) Конт.; Коло; TxP; VCC; TxN; RxP; RxN; NC; GND

### Library data of the parts
C50 C57 C59 C60 C63 = С-0603: Generic; Manufacturer: *; Tolerance: *; Package: C-0603; Temp_Coef: *; Voltage: *; Value: *
C51-C56 C58 C61 C62 = С-0402: Generic; Manufacturer: *; Tolerance: *; Package: C-0402; Temp_Coef: *; Voltage: *; Value: *
DD1 = bcm2835: BCM2835 ARM-based processor; Manufacturer: Broadcom; Name: bcm2835
DD2 = LAN9512: Ethernet + USB Controller; Name: LAN9512
HL2 HL3 = LED 0603: Generic LED 0603; Manufacturer: *; Name: LTST-C191KFKT
L4 = Ferrite Bead 0805: Generic; Manufacturer: *; Tolerance: *; Package: R-0402; Power: *; Value: *
R15-R19 R23-R27 = R-0603: Generic; Manufacturer: *; Tolerance: *; Package: R-0603; Power: *; Value: *
R20-R22 = R-0402: Generic; Manufacturer: *; Tolerance: *; Package: R-0402; Power: *; Value: *
VD2 VD3 = SS24: SS24 Shotky; Manufacturer: *; Name: SS24
XS3 XS4 = Micro-USB: as XS1 on sheet Power
XS5 = RJ-45: RJ-45 connector SMT mounting; Name: kls1-tf
ZQ2 = TXC19.2: TXC19.2 crystal 19.2 MHz; Manufacturer: *; Value: *; Name: TXC19.2

## Nets that join several sheets
+1.8: Power (17 pins), HDMI (L3.1), LAN (5 pins)
+3.3: Power (8 pins), HDMI (17 pins), LAN (27 pins)
+5: Power (14 pins), HDMI (5 pins), LAN (R15.2 R16.2)
GND: Power (111 pins), HDMI (36 pins), LAN (39 pins)
LAN_RUN: HDMI (DD1.G1), LAN (DD2.12)
NetC39_1: Power (C39.1 DD1.R8 ZQ1.3), HDMI (DD1.R8)
NetC40_1: Power (C40.1 DD1.R9 ZQ1.1), HDMI (DD1.R9)